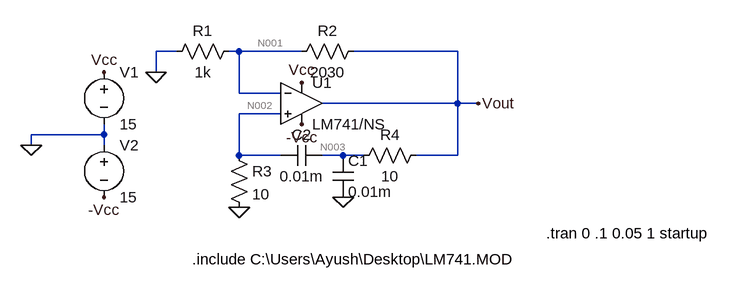
[diagram p0: schematic es17btech11002.asc]
es17btech11002.asc, the LTspice schematic file:
Version 4
SHEET 1 992 680
WIRE 16 64 -16 64
WIRE 112 64 96 64
WIRE 208 64 112 64
WIRE 448 64 288 64
WIRE -16 96 -16 64
WIRE 112 128 112 64
WIRE 176 128 112 128
WIRE 448 144 448 64
WIRE 448 144 240 144
WIRE 480 144 448 144
WIRE 176 160 112 160
WIRE -96 192 -96 176
WIRE -96 192 -208 192
WIRE -208 208 -208 192
WIRE -96 208 -96 192
WIRE 112 224 112 160
WIRE 176 224 112 224
WIRE 272 224 240 224
WIRE 304 224 272 224
WIRE 448 224 448 144
WIRE 448 224 384 224
FLAG -16 96 0
FLAG 480 144 Vout
FLAG -208 208 0
FLAG -96 96 Vcc
FLAG 208 112 Vcc
FLAG -96 288 -Vcc
FLAG 208 176 -Vcc
FLAG 112 304 0
FLAG 272 288 0
DATAFLAG 464 144 ""
SYMBOL res 112 48 R90
WINDOW 0 0 56 VBottom 2
WINDOW 3 32 56 VTop 2
SYMATTR InstName R1
SYMATTR Value 1k
SYMBOL res 304 48 R90
WINDOW 0 0 56 VBottom 2
WINDOW 3 32 56 VTop 2
SYMATTR InstName R2
SYMATTR Value 2030
SYMBOL voltage -96 80 R0
WINDOW 123 0 0 Left 2
WINDOW 39 0 0 Left 2
SYMATTR InstName V1
SYMATTR Value 15
SYMBOL voltage -96 192 R0
WINDOW 123 0 0 Left 2
WINDOW 39 0 0 Left 2
SYMATTR InstName V2
SYMATTR Value 15
SYMBOL Opamps\\opamp2 208 80 R0
SYMATTR InstName U1
SYMATTR Value LM741/NS
SYMBOL res 96 208 R0
SYMATTR InstName R3
SYMATTR Value 10
SYMBOL res 400 208 R90
WINDOW 0 0 56 VBottom 2
WINDOW 3 32 56 VTop 2
SYMATTR InstName R4
SYMATTR Value 10
SYMBOL cap 256 224 R0
SYMATTR InstName C1
SYMATTR Value 0.01m
SYMBOL cap 240 208 R90
WINDOW 0 0 32 VBottom 2
WINDOW 3 32 32 VTop 2
SYMATTR InstName C2
SYMATTR Value 0.01m
TEXT 40 384 Left 2 !.include C:\\Users\\Ayush\\Desktop\\LM741.MOD
TEXT 584 344 Left 2 !.tran 0 .1 0.05 1 startup

The netlist it stands for:
* es17btech11002.asc
R1 N001 0 1k
R2 Vout N001 2030
V1 Vcc 0 15
V2 0 -Vcc 15
XU1 N002 N001 Vcc -Vcc Vout LM741/NS  ; pins In+ In- V+ V- OUT
R3 N002 0 10
R4 Vout N003 10
C1 N003 0 0.01m
C2 N003 N002 0.01m
.include C:\Users\Ayush\Desktop\LM741.MOD
.tran 0 .1 0.05 1 startup
.backanno
.end

* Results of the author's LTspice run, read from the files saved beside the schematic
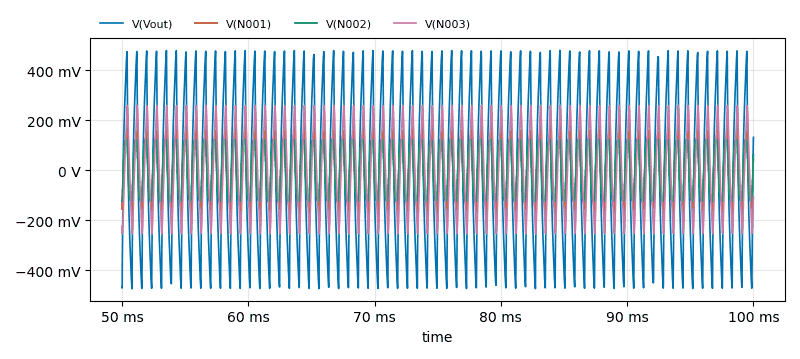
[diagram p1: Transient Analysis of es17btech11002.asc, plotted from the saved traces]
* Transient Analysis, 1 run:
*   V(Vout): min -474.4 mV, max 480.6 mV, average 2.732 mV, rms 308.6 mV, last 132 mV
*   V(N001): min -156.5 mV, max 158.5 mV, average 833.3 µV, rms 101.8 mV, last 43.54 mV
*   V(N002): min -124.6 mV, max 124.6 mV, average -133.8 µV, rms 101.1 mV, last 62.63 mV
*   V(N003): min -254.1 mV, max 260.7 mV, average 2.626 mV, rms 160.9 mV, last -104.4 mV